# EAGLE schematic AI Camera V1.0 (EAGLE 9.6.2)
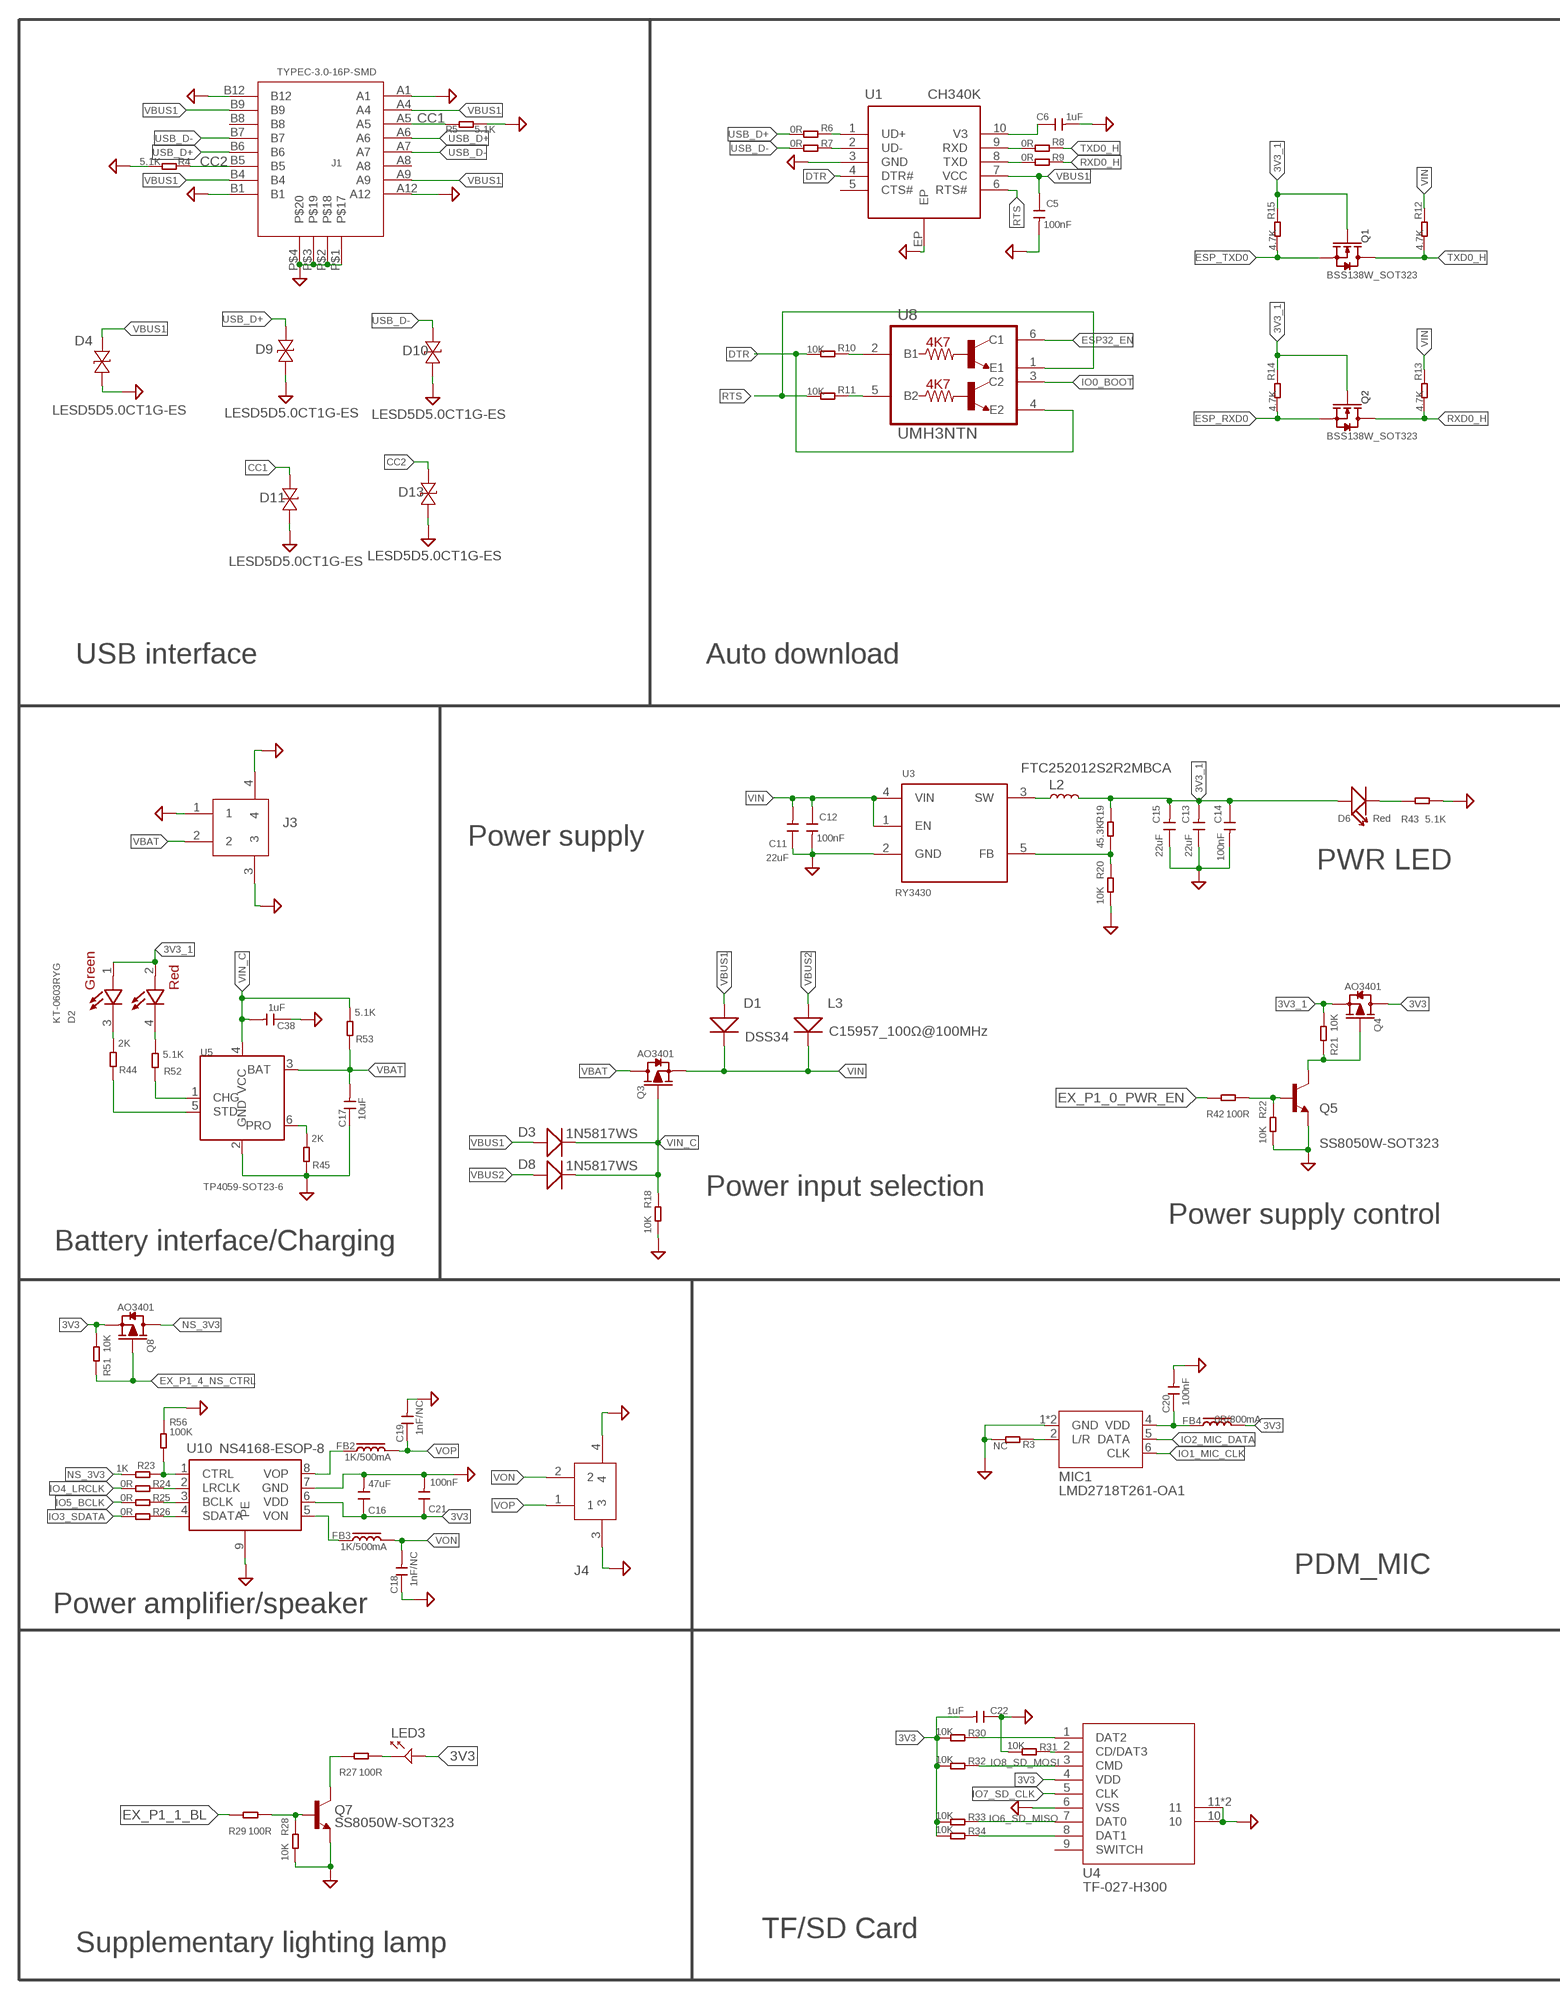
[diagram p0: schematic, sheet 1, part 1 of 2]
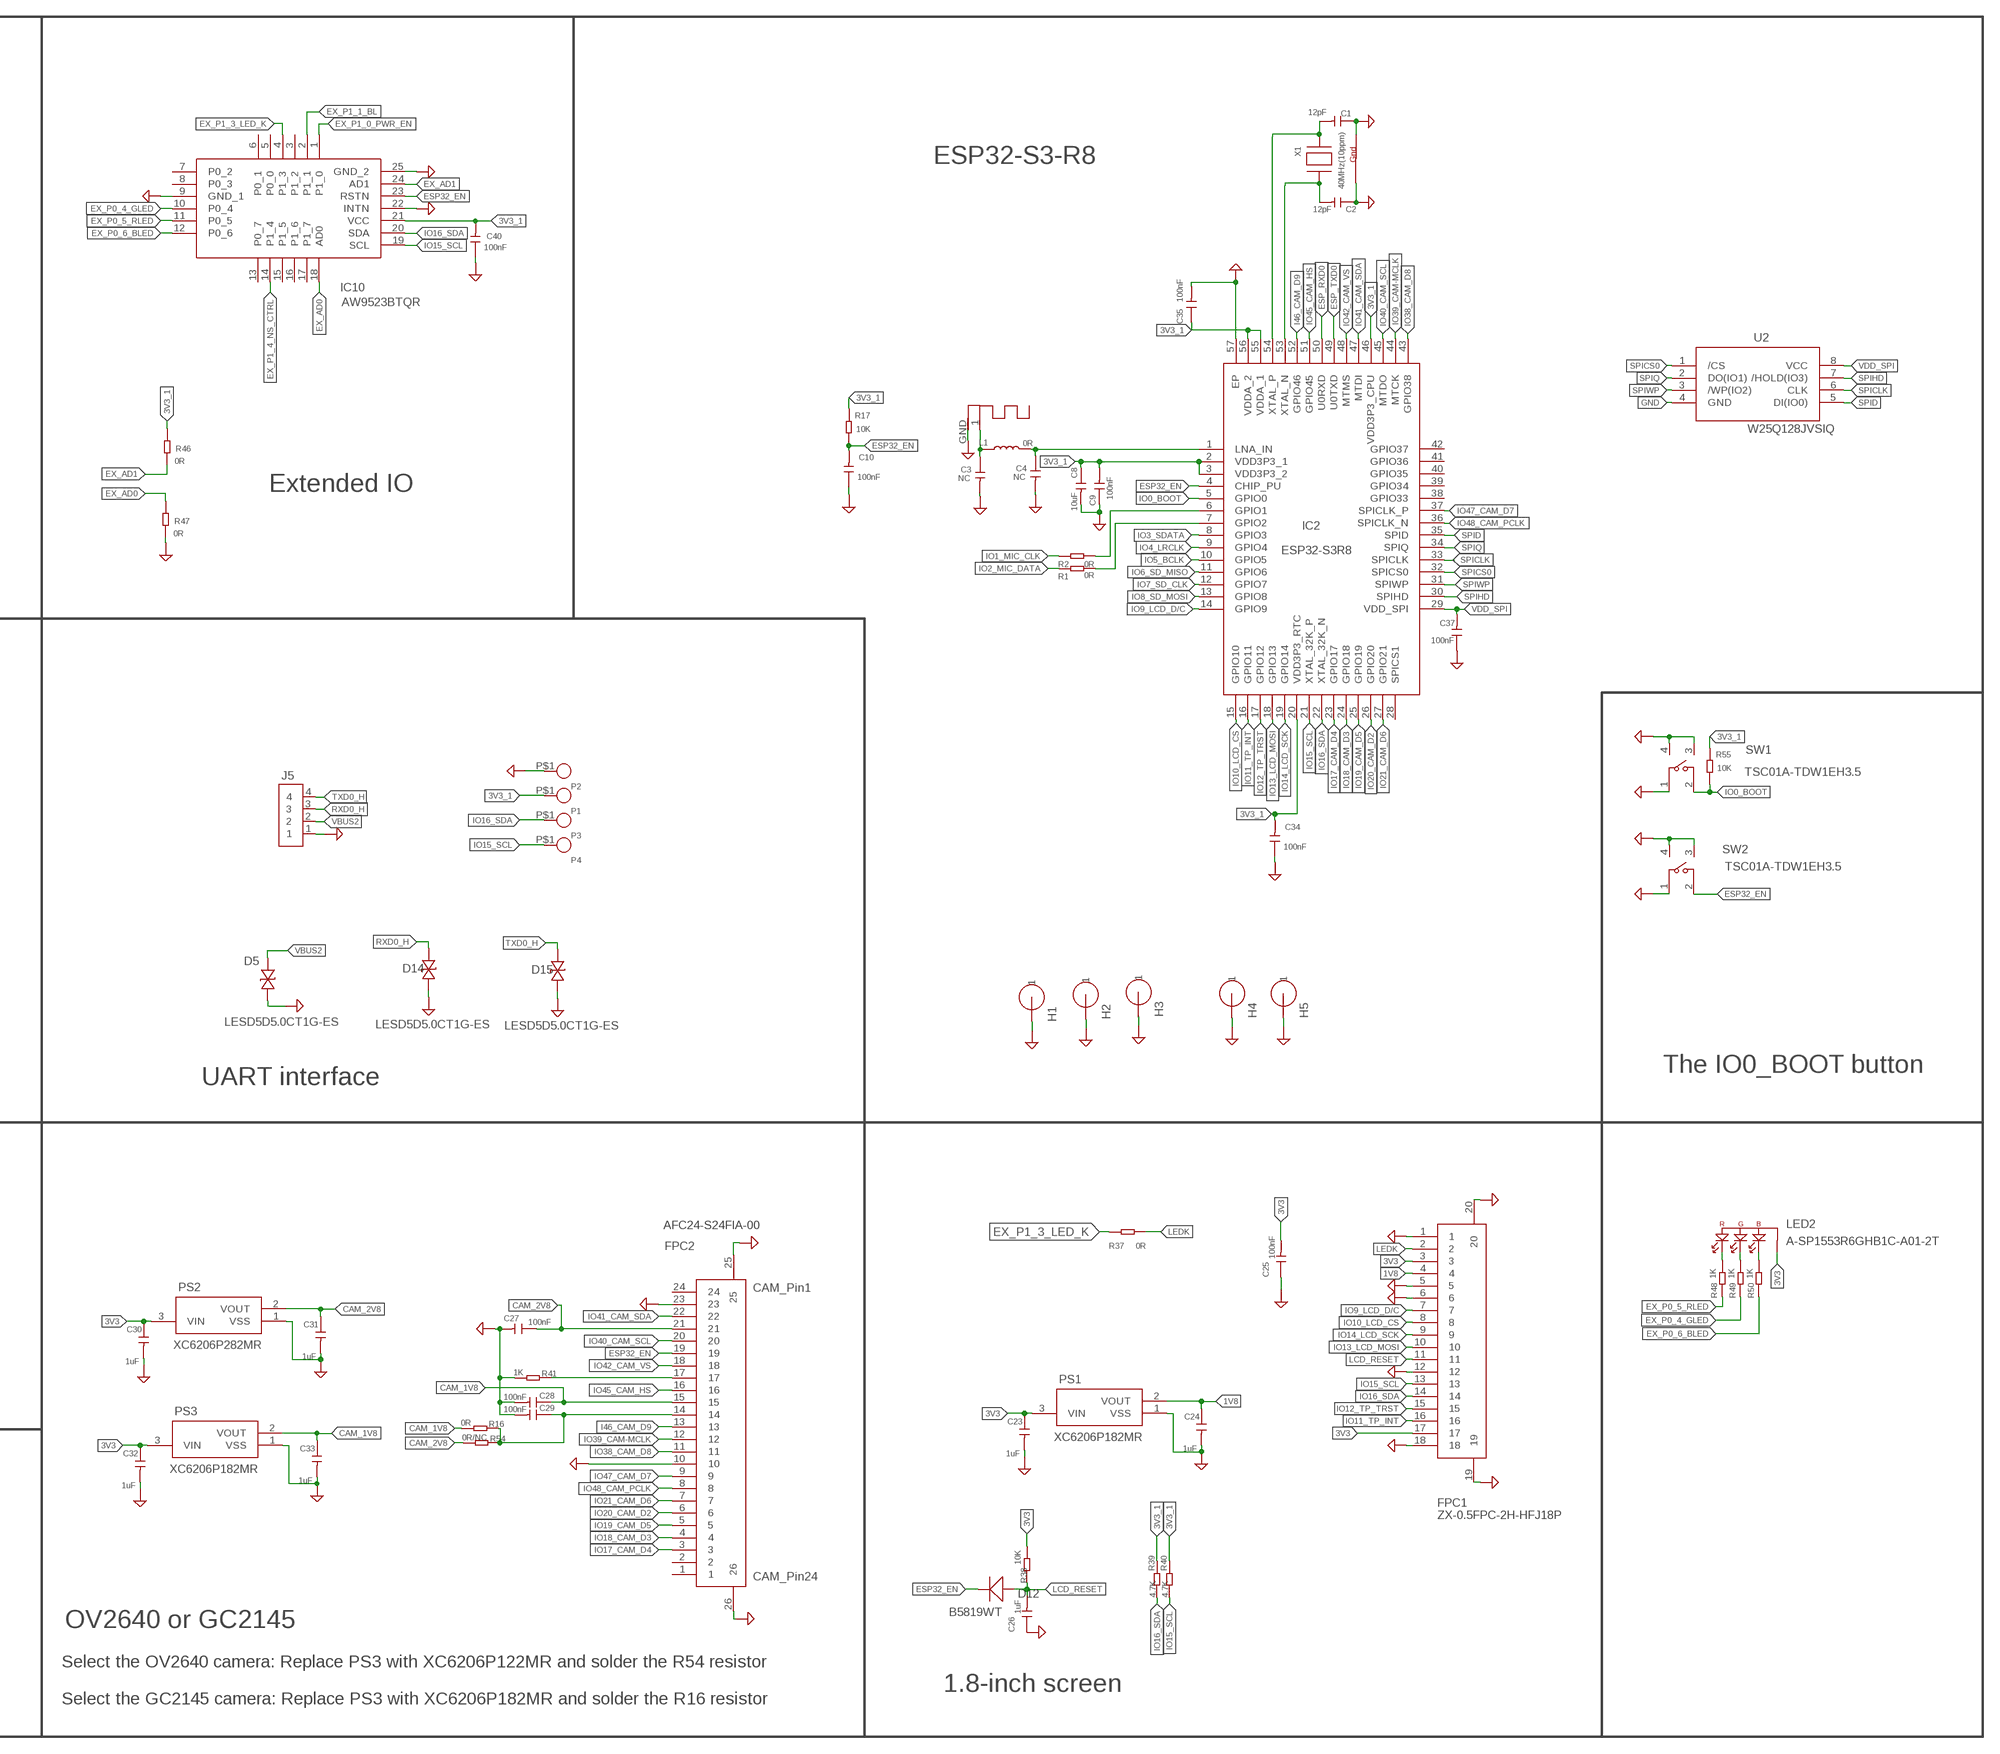
[diagram p1: schematic, sheet 1, part 2 of 2]

## Parts
ANT1  ADAFRUIT_ANTENNA  [ADAFRUIT_RN-ANT]
C1  12pF  CAPC0402-1  [C0402]
C2  12pF  CAPC0402-1  [C0402]
C3  NC  CAPC0402-1  [C0402]
C4  NC  CAPC0402-1  [C0402]
C5  100nF  CAPC0402-1  [C0402]
C6  1uF  CAPC0402-1  [C0402]
C8  10uF  CAPC0402-1  [C0402]
C9  100nF  CAPC0402-1  [C0402]
C10  100nF  CAPC0402-1  [C0402]
C11  22uF  CAP  [C0603]
C12  100nF  CAPC0402-1  [C0402]
C13  22uF  CAP  [C0603]
C14  100nF  CAPC0402-1  [C0402]
C15  22uF  CAP  [C0603]
C16  47uF  CAPC0805  [C0805]
C17  10uF  CAPC0402-1  [C0402]
C18  1nF/NC  CAPC0402-1  [C0402]
C19  1nF/NC  CAPC0402-1  [C0402]
C20  100nF  CAPC0402-1  [C0402]
C21  100nF  CAPC0402-1  [C0402]
C22  1uF  CAPC0402-1  [C0402]
C23  1uF  CAPC0402-1  [C0402]
C24  1uF  CAPC0402-1  [C0402]
C25  100nF  CAPC0402-1  [C0402]
C26  1uF  CAPC0402-1  [C0402]
C27  100nF  CAPC0402-1  [C0402]
C28  100nF  CAPC0402-1  [C0402]
C29  100nF  CAPC0402-1  [C0402]
C30  1uF  CAPC0402-1  [C0402]
C31  1uF  CAPC0402-1  [C0402]
C32  1uF  CAPC0402-1  [C0402]
C33  1uF  CAPC0402-1  [C0402]
C34  100nF  CAPC0402-1  [C0402]
C35  100nF  CAPC0402-1  [C0402]
C37  100nF  CAPC0402-1  [C0402]
C38  1uF  CAPC0402-1  [C0402]
C40  100nF  CAPC0402-1  [C0402]
D1  DSS34  DIODE  [D_SOD123FL]
D2  KT-0603RYG  [LED_KT-0603RYG]
D3  1N5817WS  DIODE0805  [D_SOD323]
D4  LESD5D5.0CT1G-ES  [SOD-523_L1.2-W0.8-LS1.6-BI]
D5  LESD5D5.0CT1G-ES  [SOD-523_L1.2-W0.8-LS1.6-BI]
D6  Red  LED-SMT0603  [LED0603]
D8  1N5817WS  DIODE0805  [D_SOD323]
D9  LESD5D5.0CT1G-ES  [SOD-523_L1.2-W0.8-LS1.6-BI]
D10  LESD5D5.0CT1G-ES  [SOD-523_L1.2-W0.8-LS1.6-BI]
D11  LESD5D5.0CT1G-ES  [SOD-523_L1.2-W0.8-LS1.6-BI]
D12  B5819WT  DIODE0603  [D_SOD523]
D13  LESD5D5.0CT1G-ES  [SOD-523_L1.2-W0.8-LS1.6-BI]
D14  LESD5D5.0CT1G-ES  [SOD-523_L1.2-W0.8-LS1.6-BI]
D15  LESD5D5.0CT1G-ES  [SOD-523_L1.2-W0.8-LS1.6-BI]
FB2  1K/500mA  FBL0603  [L0603]
FB3  1K/500mA  FBL0603  [L0603]
FB4  0R/800mA  FBL0603  [L0603]
FPC1  ZX-0.5FPC-2H-HFJ18P  [FPC-SMD_18P-P0.50_ZX-0.5FPC-2H-HFJ18P]
FPC2  AFC24-S24FIA-00  [FPC-SMD_P0.50-24P_QCHF-SM-H2.0]
H1  HOLE  [HOLE_M2]
H2  HOLE  [HOLE_M2]
H3  HOLE  [HOLE_M2]
H4  HOLE1  [LONGSTRIPHOLE]
H5  HOLE1  [LONGSTRIPHOLE]
IC2  ESP32-S3R8  [QFN40P700X700X90-57N]
IC10  AW9523BTQR  [QFN50P400X400X80-25N]
J1  TYPEC-3.0-16P-SMD  [USB-3.0TYPEC-SMD]
J3  ZX-SH1.0-2PLT1  [CONN-SMD_2P-P1.00_XUNPU_WAFER-SH1.0-2PWB]
J4  HC-1.25-2PWT  [CONN-SMD_2P-P1.25-HC-1.25-2PWT]
J5  HC-HY-4A-M  [CONN-TH_4P-P2.00_HCTL_HC-HY-4A]
L1  0R  L0402  [L0402]
L2  FTC252012S2R2MBCA  [IND-SMD_L2.5-W2.0_MHCHL2520]
L3  C15957_100Ω@100MHz  DIODE  [D_SOD123FL]
LED2  A-SP1553R6GHB1C-A01-2T  [LED-SMD_4P-L3.2-W2.7-BL_A-SP1553R6GHB1C-A01-2T]
LED3  3014_LED  [LED_3014_SMT]
MIC1  LMD2718T261-OA1  [MIC-SMD_6P-L2.8-W1.9-P0.98-TL]
P1  TEST_PADPAD-1.5MM  [TEST_PAD-1.5MM]
P2  TEST_PADPAD-1.5MM  [TEST_PAD-1.5MM]
P3  TEST_PADPAD-1.5MM  [TEST_PAD-1.5MM]
P4  TEST_PADPAD-1.5MM  [TEST_PAD-1.5MM]
PS1  XC6206P182MR  [SOT95P280X130-3N]
PS2  XC6206P282MR  XC6206P182MR  [SOT95P280X130-3N]
PS3  XC6206P182MR  [SOT95P280X130-3N]
Q1  BSS138W_SOT323  MOSFET-NSI1304BDL  [MOS_SOT323]
Q2  BSS138W_SOT323  MOSFET-NSI1304BDL  [MOS_SOT323]
Q3  AO3401  MOSFET-PSOT23  [PMOS_SOT23]
Q4  AO3401  MOSFET-PSOT23  [PMOS_SOT23]
Q5  SS8050W-SOT323  TRANS_NPN  [MOS_SOT323]
Q7  SS8050W-SOT323  TRANS_NPN  [MOS_SOT323]
Q8  AO3401  MOSFET-PSOT23  [PMOS_SOT23]
R1  0R  RES-0402  [R0402]
R2  0R  RES-0402  [R0402]
R3  NC  RES-0402  [R0402]
R4  5.1K  RES-0402  [R0402]
R5  5.1K  RES-0402  [R0402]
R6  0R  RES-0402  [R0402]
R7  0R  RES-0402  [R0402]
R8  0R  RES-0402  [R0402]
R9  0R  RES-0402  [R0402]
R10  10K  RES-0402  [R0402]
R11  10K  RES-0402  [R0402]
R12  4.7K  RES-0402  [R0402]
R13  4.7K  RES-0402  [R0402]
R14  4.7K  RES-0402  [R0402]
R15  4.7K  RES-0402  [R0402]
R16  0R  RES-0402  [R0402]
R17  10K  RES-0402  [R0402]
R18  10K  RES-0402  [R0402]
R19  45.3K  RES-0402  [R0402]
R20  10K  RES-0402  [R0402]
R21  10K  RES-0402  [R0402]
R22  10K  RES-0402  [R0402]
R23  1K  RES-0402  [R0402]
R24  0R  RES-0402  [R0402]
R25  0R  RES-0402  [R0402]
R26  0R  RES-0402  [R0402]
R27  100R  RES-0402  [R0402]
R28  10K  RES-0402  [R0402]
R29  100R  RES-0402  [R0402]
R30  10K  RES-0402  [R0402]
R31  10K  RES-0402  [R0402]
R32  10K  RES-0402  [R0402]
R33  10K  RES-0402  [R0402]
R34  10K  RES-0402  [R0402]
R37  0R  RES-0402  [R0402]
R38  10K  RES-0402  [R0402]
R39  4.7K  RES-0402  [R0402]
R40  4.7K  RES-0402  [R0402]
R41  1K  RES-0402  [R0402]
R42  100R  RES-0402  [R0402]
R43  5.1K  RES-0402  [R0402]
R44  2K  RES-0402  [R0402]
R45  2K  RES-0402  [R0402]
R46  0R  RES-0402  [R0402]
R47  0R  RES-0402  [R0402]
R48  1K  RES-0402  [R0402]
R49  1K  RES-0402  [R0402]
R50  1K  RES-0402  [R0402]
R51  10K  RES-0402  [R0402]
R52  5.1K  RES-0402  [R0402]
R53  5.1K  RES-0402  [R0402]
R54  0R/NC  RES-0402  [R0402]
R55  10K  RES-0402  [R0402]
R56  100K  RES-0402  [R0402]
SW1  TSC01A-TDW1EH3.5  [KEY-SMD_4P-L4.6-W2.4_TSC01A-TDW1FH3.5]
SW2  TSC01A-TDW1EH3.5  [KEY-SMD_4P-L4.6-W2.4_TSC01A-TDW1FH3.5]
U1  CH340K  [ESOP-10-EP-150MIL]
U2  W25Q128JVSIQ  CKP_W25QXXSOP  [CKP_W25QXX-SOP-8-208MIL]
U3  RY3430  HM3416H  [IC_SOT23-5]
U4  TF-027-H300  TF-SMD_TF-123-ARP9H15  [TF-SMD_HYCW104-TF08-375B]
U5  TP4059-SOT23-6  [SOT23-6L]
U8  UMH3NTN  [SOP65P210X100-6N]
U10  NS4168-ESOP-8  [NS4168-ESOP-8]
X1  40MHz(10ppm)  ADAFRUIT_XTAL-4-3225  [ADAFRUIT_NX3225]

## Nets
1V8: C24.1 FPC1.4 PS1.2(VOUT)
3V3: C16.1 C21.1 C22.2 C23.1 C25.2 C30.1 C32.1 FB4.2 FPC1.3 FPC1.17 LED2.3(GND) LED3.1 PS1.3(VIN) PS2.3(VIN) PS3.3(VIN) Q4.3(D) Q8.2(S) R30.2 R32.2 R33.2 R34.2 R38.2 R51.2 U4.4(VDD) U10.6(VDD)
3V3_1: C8.1 C9.2 C13.2 C14.1 C15.2 C34.2 C35.1 C40.2 D2.1 D2.2 D6.+ IC2.2(VDD3P3_1) IC2.3(VDD3P3_2) IC2.20(VDD3P3_RTC) IC2.46(VDD3P3_CPU) IC2.55(VDDA_1) IC2.56(VDDA_2) IC10.21(VCC) L2.2 P1.P$1 Q1.1(G) Q2.1(G) Q4.2(S) R14.1 R15.1 R17.1 R19.1 R21.2 R39.1 R40.1 R46.1 R55.1
CAM_1V8: C28.1 C33.1 FPC2.15 PS3.2(VOUT) R16.2
CAM_2V8: C27.1 C31.1 FPC2.21 PS2.2(VOUT) R54.2
CC1: D11.2 J1.A5 R5.1
CC2: D13.2 J1.B5 R4.1
DOVDD: C29.1 FPC2.14 R16.1 R54.1
DTR: R10.2 U1.4(DTR#) U8.4(E2)
ESP32_EN: C10.2 D12.- FPC2.19 IC2.4(CHIP_PU) IC10.23(RSTN) R17.2 SW2.2 U8.6(C1)
ESP_RXD0: IC2.50(U0RXD) Q2.2(S) R14.2
ESP_TXD0: IC2.49(U0TXD) Q1.2(S) R15.2
EX_AD0: IC10.18(AD0) R47.1
EX_AD1: IC10.24(AD1) R46.2
EX_P0_4_GLED: IC10.10(P0_4) R49.1
EX_P0_5_RLED: IC10.11(P0_5) R48.1
EX_P0_6_BLED: IC10.12(P0_6) R50.1
EX_P1_0_PWR_EN: IC10.1(P1_0) R42.1
EX_P1_1_BL: IC10.2(P1_1) R29.1
EX_P1_3_LED_K: IC10.4(P1_3) R37.1
EX_P1_4_NS_CTRL: IC10.14(P1_4) Q8.1(G) R51.1
GND: ANT1.GND C1.1 C2.1 C3.2 C4.2 C5.2 C6.2 C8.2 C9.1 C10.1 C11.1 C12.2 C13.1 C14.2 C15.1 C16.2 C17.1 C18.1 C19.2 C20.2 C21.2 C22.1 C23.2 C24.2 C25.1 C26.1 C27.2 C28.2 C29.2 C30.2 C31.2 C32.2 C33.2 C34.1 C35.2 C37.1 C38.1 C40.1 D4.1 D5.1 D9.1 D10.1 D11.1 D13.1 D14.1 D15.1 FPC1.1 FPC1.5 FPC1.6 FPC1.12 FPC1.18 FPC1.19 FPC1.20 FPC2.10 FPC2.23 FPC2.25 FPC2.26 H1.1 H2.1 H3.1 H4.1 H4.2 H5.1 H5.2 IC2.57(EP) IC10.9(GND_1) IC10.22(INTN) IC10.25(GND_2) J1.A1 J1.A12 J1.B1 J1.B12 J1.P$1 J1.P$2 J1.P$3 J1.P$4 J3.1 J3.3 J3.4 J4.3 J4.4 J5.1 MIC1.1(GND) MIC1.3(GND) P2.P$1 PS1.1(VSS) PS2.1(VSS) PS3.1(VSS) Q5.2(E) Q7.2(E) R3.2 R4.2 R5.2 R18.2 R20.2 R22.2 R28.2 R31.2 R41.2 R43.2 R45.1 R47.2 R56.1 SW1.1 SW1.3 SW1.4 SW2.1 SW2.3 SW2.4 U1.3(GND) U1.EP U2.4(GND) U3.2(GND) U4.6(VSS) U4.10 U4.11 U4.12 U5.2(GND) U10.7(GND) U10.9(PE) X1.2(G2) X1.4(G1)
I46_CAM_D9: FPC2.13 IC2.52(GPIO46)
IO0_BOOT: IC2.5(GPIO0) R55.2 SW1.2 U8.3(C2)
IO1_MIC_CLK: MIC1.6(CLK) R1.1
IO2_MIC_DATA: MIC1.5(DATA) R2.1
IO3_SDATA: IC2.8(GPIO3) R26.2
IO4_LRCLK: IC2.9(GPIO4) R24.2
IO5_BCLK: IC2.10(GPIO5) R25.2
IO6_SD_MISO: IC2.11(GPIO6) R33.1 U4.7(DAT0)
IO7_SD_CLK: IC2.12(GPIO7) U4.5(CLK)
IO8_SD_MOSI: IC2.13(GPIO8) R32.1 U4.3(CMD)
IO9_LCD_D/C: FPC1.7 IC2.14(GPIO9)
IO10_LCD_CS: FPC1.8 IC2.15(GPIO10)
IO11_TP_INT: FPC1.16 IC2.16(GPIO11)
IO12_TP_TRST: FPC1.15 IC2.17(GPIO12)
IO13_LCD_MOSI: FPC1.10 IC2.18(GPIO13)
IO14_LCD_SCK: FPC1.9 IC2.19(GPIO14)
IO15_SCL: FPC1.13 IC2.21(XTAL_32K_P) IC10.19(SCL) P4.P$1 R40.2
IO16_SDA: FPC1.14 IC2.22(XTAL_32K_N) IC10.20(SDA) P3.P$1 R39.2
IO17_CAM_D4: FPC2.3 IC2.23(GPIO17)
IO18_CAM_D3: FPC2.4 IC2.24(GPIO18)
IO19_CAM_D5: FPC2.5 IC2.25(GPIO19)
IO20_CAM_D2: FPC2.6 IC2.26(GPIO20)
IO21_CAM_D6: FPC2.7 IC2.27(GPIO21)
IO38_CAM_D8: FPC2.11 IC2.43(GPIO38)
IO39_CAM-MCLK: FPC2.12 IC2.44(MTCK)
IO40_CAM_SCL: FPC2.20 IC2.45(MTDO)
IO41_CAM_SDA: FPC2.22 IC2.47(MTDI)
IO42_CAM_VS: FPC2.18 IC2.48(MTMS)
IO45_CAM_HS: FPC2.16 IC2.51(GPIO45)
IO47_CAM_D7: FPC2.9 IC2.37(SPICLK_P)
IO48_CAM_PCLK: FPC2.8 IC2.36(SPICLK_N)
LCD_RESET: C26.2 D12.+ FPC1.11 R38.1
LEDK: FPC1.2 R37.2
N$1: IC2.6(GPIO1) R1.2
N$2: R31.1 U4.2(CD/DAT3)
N$3: MIC1.2(L/R) R3.1
N$6: ANT1.1(FEED) C3.1 L1.1
N$7: C4.1 IC2.1(LNA_IN) L1.2
N$8: D6.- R43.1
N$9: D2.4 R52.2
N$10: R7.1 U1.2(UD-)
N$11: R6.1 U1.1(UD+)
N$12: R8.2 U1.9(RXD)
N$13: R9.2 U1.8(TXD)
N$14: R10.1 U8.2(B1)
N$15: R11.1 U8.5(B2)
N$16: C6.1 U1.10(V3)
N$17: IC2.7(GPIO2) R2.2
N$18: R52.1 U5.1(CHG)
N$19: L2.1 U3.3(SW)
N$20: C2.2 IC2.53(XTAL_N) X1.3(X2)
N$21: R19.2 R20.1 U3.5(FB)
N$22: R24.1 U10.2(LRCLK)
N$23: R25.1 U10.3(BCLK)
N$24: R26.1 U10.4(SDATA)
N$25: Q4.1(G) Q5.3(C) R21.1
N$26: Q5.1(B) R22.1 R42.2
N$27: R45.2 U5.6(PRO)
N$28: FB3.1 U10.5(VON)
N$29: FB2.1 U10.8(VOP)
N$30: C20.1 FB4.1 MIC1.4(VDD)
N$31: LED3.2 R27.2
N$32: Q7.3(C) R27.1
N$33: Q7.1(B) R28.1 R29.2
N$34: LED2.2(R) R48.2
N$35: R30.1 U4.1(DAT2)
N$36: C1.2 IC2.54(XTAL_P) X1.1(X1)
N$38: FPC2.17 R41.1
N$39: LED2.1(G) R49.2
N$40: LED2.4(B) R50.2
N$42: R34.1 U4.8(DAT1)
N$43: D2.3 R44.2
N$44: R44.1 U5.5(STD)
NS_3V3: Q8.3(D) R23.2
NS_CTRL: R23.1 R56.2 U10.1(CTRL)
RTS: R11.2 U1.6(RTS#) U8.1(E1)
RXD0_H: D14.2 J5.3 Q2.3(D) R9.1 R13.2
SPICLK: IC2.33(SPICLK) U2.6(CLK)
SPICS0: IC2.32(SPICS0) U2.1(/CS)
SPID: IC2.35(SPID) U2.5(DI(IO0))
SPIHD: IC2.30(SPIHD) U2.7(/HOLD(IO3))
SPIQ: IC2.34(SPIQ) U2.2(DO(IO1))
SPIWP: IC2.31(SPIWP) U2.3(/WP(IO2))
TXD0_H: D15.2 J5.4 Q1.3(D) R8.1 R12.2
USB_D+: D9.2 J1.A6 J1.B6 R6.2
USB_D-: D10.2 J1.A7 J1.B7 R7.2
VBAT: C17.2 J3.2 Q3.3(D) R53.1 U5.3(BAT)
VBUS1: C5.1 D1.+ D3.+ D4.2 J1.A4 J1.A9 J1.B4 J1.B9 U1.7(VCC)
VBUS2: D5.2 D8.+ J5.2 L3.+
VDD_SPI: C37.2 IC2.29(VDD_SPI) U2.8(VCC)
VIN: C11.2 C12.1 D1.- L3.- Q3.2(S) R12.1 R13.1 U3.1(EN) U3.4(VIN)
VIN_C: C38.2 D3.- D8.- Q3.1(G) R18.1 R53.2 U5.4(VCC)
VON: C18.2 FB3.2 J4.2
VOP: C19.1 FB2.2 J4.1
Unconnected: FPC2.1 FPC2.2 FPC2.24 IC2.28(SPICS1) IC2.38(GPIO33) IC2.39(GPIO34) IC2.40(GPIO35) IC2.41(GPIO36) IC2.42(GPIO37) IC10.3(P1_2) IC10.5(P0_0) IC10.6(P0_1) IC10.7(P0_2) IC10.8(P0_3) IC10.13(P0_7) IC10.15(P1_5) IC10.16(P1_6) IC10.17(P1_7) J1.A8 J1.B8 U1.5(CTS#) U4.9(SWITCH)

## Notes on the sheet
- ESP32-S3-R8
- Extended IO
- USB interface | Auto download
- Power supply
- PWR LED
- Power input selection
- Power supply control | The IO0_BOOT button
- UART interface
- Battery interface/Charging
- CAM_Pin1
- PDM_MIC
- Power amplifier/speaker
- CAM_Pin24
- OV2640 or GC2145
- 1.8-inch screen
- TF/SD Card
- Select the OV2640 camera: Replace PS3 with XC6206P122MR and solder the R54 resistor
  
  Select the GC2145 camera: Replace PS3 with XC6206P182MR and solder the R16 resistor
- Supplementary lighting lamp

## Library data of the parts
ANT1 = ESP32-S3 4.2“ EINK V1.3:ADAFRUIT_ANTENNA
C1-C6 C8-C35 C37 C38 C40 = CrowPanel_Advance_HMI:CAP*
D1 D3 D8 D12 L3 = CrowPanel_Advance_HMI:DIODE*
D2 = KT-0603RYG:KT-0603RYG: Check availability <https://pricing.snapeda.com/parts/KT-0603R/Hubei%20KENTO%20Elec/view-part?ref=eda>
D4 D5 D9-D11 D13-D15 = LESD5D5.0CT1G-ES:LESD5D5.0CT1G-ES
D6 = CrowPanel_Advance_HMI:LED-SMT*
FB2-FB4 = CrowPanel_Advance_HMI:FB*
FPC1 = ZX-0.5FPC-2H-HFJ18P:ZX-0.5FPC-2H-HFJ18P
FPC2 = FPC:AFC24-S24FIA-00
H1-H5 = HOLE:HOLE
IC2 = ESP32-S3R8:ESP32-S3R8: WiFi Modules - 802.11 SMD IC, Dual-Core MCU, Wi-Fi 2.4G & BLE 5.0 Combo, 8 MB Octal SPI PSRAM, QFN 56-pin, 7*7 mm Source: Datasheet <https://www.espressif.com/sites/default/files/documentation/esp32-s3_datasheet_en.pdf>; DESCRIPTION: WiFi Modules - 802.11 SMD IC, Dual-Core MCU, Wi-Fi 2.4G & BLE 5.0 Combo, 8 MB Octal SPI PSRAM, QFN 56-pin, 7*7 mm; HEIGHT: 0.9mm; MANUFACTURER_NAME: Espressif Systems; MANUFACTURER_PART_NUMBER: ESP32-S3R8; MOUSER_PART_NUMBER: 356-ESP32-S3R8; MOUSER_PRICE-STOCK: https://www.mouser.co.uk/ProductDetail/Espressif-Systems/ESP32-S3R8?qs=Rp5uXu7WBW%252Bto4RqH8CMng%3D%3D
IC10 = AW9523BTQR:AW9523BTQR: 16 MULTI-FUNCTION LED DRIVER AND GPIO CONTROLLER WITH I2C INTERFACE Source: Datasheet <https://www.alldatasheet.net/datasheet-pdf/pdf/1148543/AWINIC/AW9523BTQR.html>; DESCRIPTION: 16 MULTI-FUNCTION LED DRIVER AND GPIO CONTROLLER WITH I2C INTERFACE; HEIGHT: 0.8mm; MANUFACTURER_NAME: AWINIC; MANUFACTURER_PART_NUMBER: AW9523BTQR
J1 = CrowPanel_Advance_HMI:TYPEC-3.0-16P-SMD
J3 = Mini PC Case:ZX-SH1.0-2PLT
J4 = HC-1.25-2PWT:HC-1.25-2PWT
J5 = HC-HY-4A-M:HC-HY-4A-M
L1 = SX1302_Module:L*
L2 = FTC252012S2R2MBCA:FTC252012S2R2MBCA
LED2 = A-SP1553R6GHB1C-A01-2T:A-SP1553R6GHB1C-A01-2T
LED3 = 3014 LED:3014_LED
MIC1 = LMD2718T261-OA1:LMD2718T261-OA1
P1-P4 = CrowPanel_Advance_HMI:TEST_PAD*
PS1-PS3 = XC6206P182MR:XC6206P182MR: TOREX - XC6206P182MR - V REG LDO 0.25A 1.8V, SMD, SOT-23-3 Source: Datasheet <https://componentsearchengine.com/Datasheets/2/XC6206P182MR.pdf>; DESCRIPTION: TOREX - XC6206P182MR - V REG LDO 0.25A 1.8V, SMD, SOT-23-3; HEIGHT: 1.3mm; MANUFACTURER_NAME: Torex; MANUFACTURER_PART_NUMBER: XC6206P182MR; MOUSER_PART_NUMBER: N/A; MOUSER_PRICE-STOCK: https://www.mouser.co.uk/ProductDetail/Torex-Semiconductor/XC6206P182MR?qs=TiOZkKH1s2SmChsoHvNJRg%3D%3D
Q1 Q2 = CrowPanel_Advance_HMI:MOSFET-N*: IRLL014: http://www.vishay.com/docs/91319/sihll014.pdf
Q3 Q4 Q8 = CrowPanel_Advance_HMI:MOSFET-P: IRLL014: http://www.vishay.com/docs/91319/sihll014.pdf
Q5 Q7 = CrowPanel_Advance_HMI:TRANS_NPN: NPN transistor Current controlled devices typically used to amplify current or used as a switch. BC547 - COM-08928 <http://www.sparkfun.com/products/8928> (TO-92 45V 100mA) (1.Collector 2.Base 3.Emitter) 2N3904 - COM-00521 <http://www.sparkfun.com/products/521> (TO-92 40V 200mA) (1.Emitter 2.Base 3.Collector) P2N2222A - COM-12852 <http://www.sparkfun.com/products/12852> (TO-92 40V 600mA) (1.Collector 2.Base 3.Emitter)
R1-R34 R37-R56 = CrowPanel_Advance_HMI:RES*
SW1 SW2 = TSC01A-TDW1EH3.5:TSC01A-TDW1EH3.5
U1 = sale:CH340K
U2 = W25QXX:CKP_W25QXX
U3 = CrowPanel_Advance_HMI:HM3416H
U4 = SD-CARD:TF-SMD_TF-123-ARP9H15
U5 = CrowPanel_Advance_HMI:TP4059-SOT23-6
U8 = UMH3NTN:UMH3NTN: Dual NPN BJT with 4.7K Base resistor Datasheet <https://fscdn.rohm.com/en/products/databook/datasheet/discrete/transistor/digital/umh3ntn-e.pdf> BUY NOW <https://www.digikey.ca/en/products/detail/rohm-semiconductor/umh3ntn/659279> Check availability <https://pricing.snapeda.com/parts/UMH3NTN/Rohm/view-part?ref=eda>; AVAILABILITY: In Stock; CHECK_PRICES: https://www.snapeda.com/parts/UMH3NTN/Rohm/view-part/?ref=eda; DESCRIPTION: Pre-Biased Bipolar Transistor (BJT) 2 NPN - Pre-Biased (Dual) 50V 100mA 250MHz 150mW Surface Mount UMT6; MF: Rohm; MP: UMH3NTN; PACKAGE: SOT-363 Rohm; PRICE: None; PURCHASE-URL: https://www.snapeda.com/api/url_track_click_mouser/?unipart_id=355768&manufacturer=Rohm&part_name=UMH3NTN&search_term=umh3n; SNAPEDA_LINK: https://www.snapeda.com/parts/UMH3NTN/Rohm/view-part/?ref=snap
U10 = STC_MCUSTC8G1K08A:NS4168-ESOP-8
X1 = ESP32-S3 4.2“ EINK V1.3:ADAFRUIT_XTAL-4: Classic 4-pin 3.2 x 2.5mm crystal